# Altium project Simulation.PrjPcb
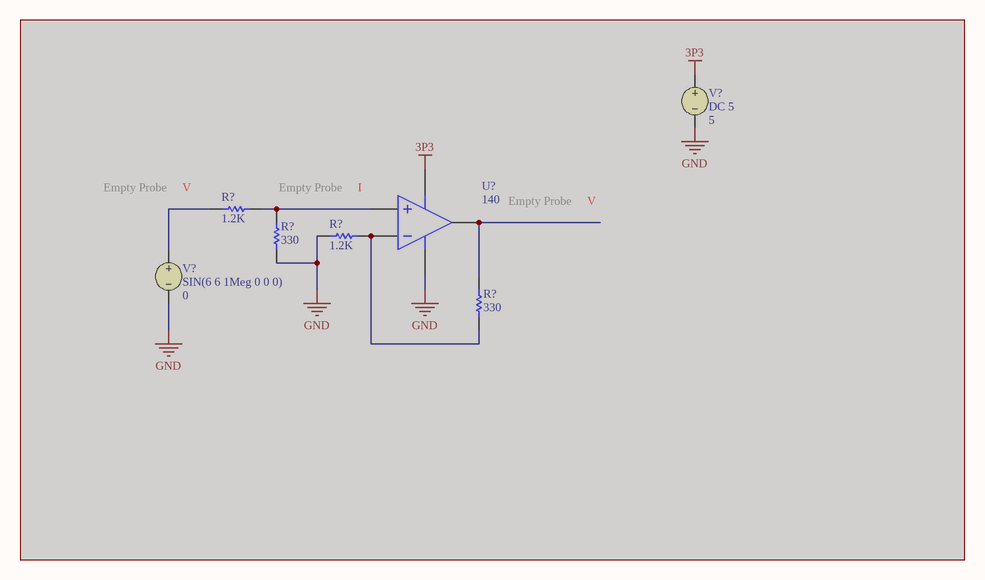
[diagram p0: Simulation.SchDoc]
1 sheet, 7 parts. Net scope: global (net labels, ports and power ports of the same name join across sheets).

## Sheet Simulation.SchDoc
size A4; SheetNumber: 1; SheetTotal: 1

### Parts
(Parts that share a designator on the sheet are numbered #1, #2 ... from top to bottom, then left to right.)
R?#1  value 1.2K  (hidden comment: Resistor)  (masked out: inside a compile mask, not in the netlist)
R?#2  value 1.2K  (hidden comment: Resistor)  (masked out: inside a compile mask, not in the netlist)
R?#3  value 330  (hidden comment: Resistor)  (masked out: inside a compile mask, not in the netlist)
R?#4  value 330  (hidden comment: Resistor)  (masked out: inside a compile mask, not in the netlist)
U?  GAIN: 140  (hidden comment: Ideal Operational Amplifier)  (masked out: inside a compile mask, not in the netlist)
V?#1  DC 5  value 5  (masked out: inside a compile mask, not in the netlist)
V?#2  SIN(6 6 1Meg 0 0 0)  DC Magnitude: 0  (masked out: inside a compile mask, not in the netlist)

### Library data of the parts
R?#1-R?#4 = Resistor: TC1: 0; SimulationGenericComponent: True; TC2: 0
U? = OpAmp with power terminals: SimulationGenericComponent: True
V?#1 = VSRC: Voltage Source; Note: PCB Footprint - Not required; AC Magnitude: 1; AC Phase: 0; Published: 30-July-2020; LatestRevisionDate: 30-July-2020; LatestRevisionNote: Re-released for DXP Platform.; PackageReference: Not Applicable; Publisher: Altium Limited
V?#2 = VSRC: Voltage Source; Note: PCB Footprint - Not required; Offset: 6; Published: 30-July-2020; LatestRevisionDate: 30-July-2020; LatestRevisionNote: Re-released for DXP Platform.; PackageReference: Not Applicable; Publisher: Altium Limited; AC Magnitude: 0; AC Phase: 0; Amplitude: 6; Frequency: 1Meg; Delay: 0; Damping Factor: 0; Phase: 0